# EasyEDA Pro project F401.eprj

# Schematic Schematic1
Board Name: Board1; Create Date: 2025-04-14; Page Name: P1; Project Name: F401; Schematic Name: Schematic1; Update Date: 2025-04-25; Company: 嘉立创EDA; Page Size: A4; Version: V1.0
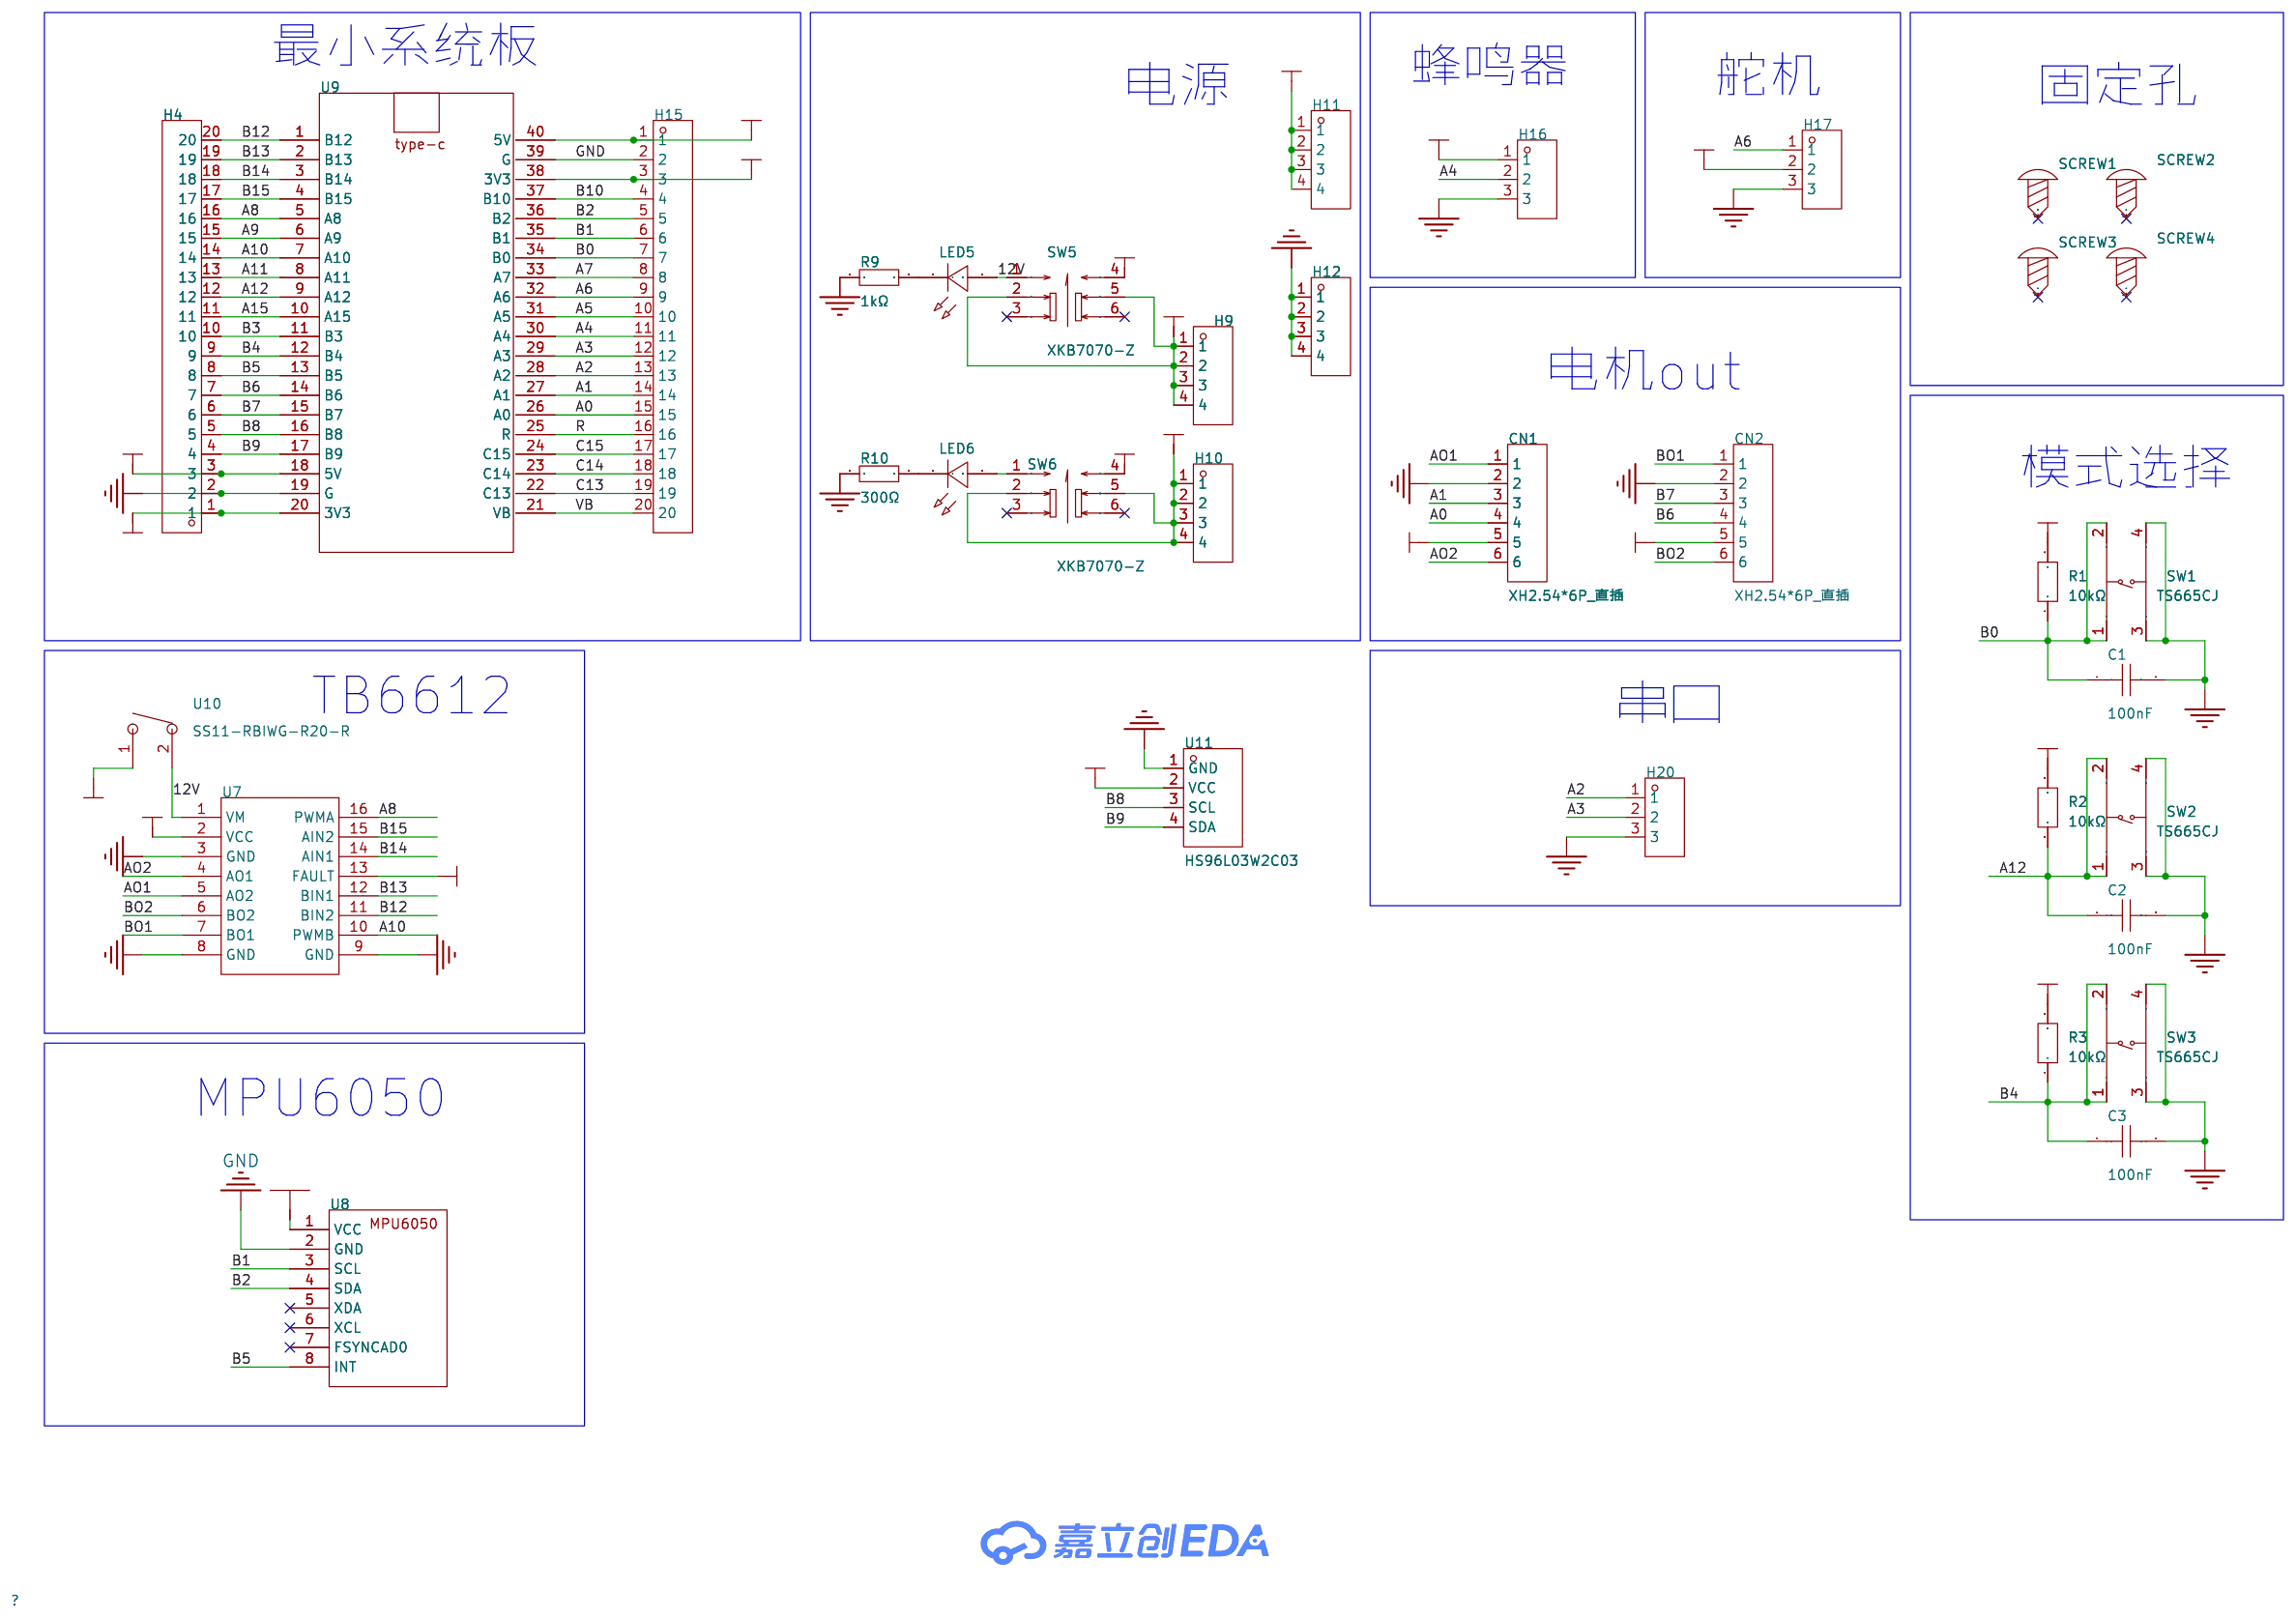
[diagram p0: schematic sheet]

## Parts
C1  100nF  [CAP-TH_L5.0-W2.5-P5.00-D1.0]
C2  100nF  [CAP-TH_L5.0-W2.5-P5.00-D1.0]
C3  100nF  [CAP-TH_L5.0-W2.5-P5.00-D1.0]
CN1  XH2.54*6P_直插  [CONN-TH_XH2.54-6P]
CN2  XH2.54*6P_直插  [CONN-TH_XH2.54-6P]
H4  -  [HDR-TH_20P-P2.54-V-M-1]
H9  -  [HDR-TH_4P-P2.54-V-M]
H10  -  [HDR-TH_4P-P2.54-V-M]
H11  -  [HDR-TH_4P-P2.54-V-M]
H12  -  [HDR-TH_4P-P2.54-V-M]
H15  -  [HDR-TH_20P-P2.54-V-M-1]
H16  -  [HDR-TH_3P-P2.54-V-F]
H17  -  [HDR-TH_3P-P2.54-V-M]
H20  -  [HDR-TH_3P-P2.54-V-M]
LED5  -  [LED-TH_5mm]
LED6  -  [LED-TH_5mm]
R1  10kΩ  [RES-TH_BD2.7-L6.2-P10.20-D0.4]
R2  10kΩ  [RES-TH_BD2.7-L6.2-P10.20-D0.4]
R3  10kΩ  [RES-TH_BD2.7-L6.2-P10.20-D0.4]
R9  1kΩ  [Res_1/4W]
R10  300Ω  [Res_1/4W]
SCREW1  -  [M3螺丝]
SCREW2  -  [M3螺丝]
SCREW3  -  [M3螺丝]
SCREW4  -  [M3螺丝]
SW1  TS665CJ  [SW-TH_4P-L6.0-W6.0-P4.50-LS6.5]
SW2  TS665CJ  [SW-TH_4P-L6.0-W6.0-P4.50-LS6.5]
SW3  TS665CJ  [SW-TH_4P-L6.0-W6.0-P4.50-LS6.5]
SW5  XKB7070-Z  [SW-TH_6P-L7.0-W7.0-P2.00]
SW6  XKB7070-Z  [SW-TH_6P-L7.0-W7.0-P2.00]
U7  -  [TB6612FNG]
U8  -  [MPU6050]
U9  -  [F401CCU6]
U10  SS11-RBIWG-R20-R  [SW-TH_L21.0-W15.0_SS11-RBIWG-R20-R]
U11  HS96L03W2C03  [OLED-TH_L27.8-W27.2-P2.54_C9900033791]

## Library data of the parts
C1-C3 = CC1H104MC1FD3F6C10MF: LCSC Part Name: 100nF ±20% 50V; Supplier Part: C254085; Manufacturer: Dersonic(德尔创); Supplier Footprint: 插件,P=5.08mm; JLCPCB Part Class: 扩展库; Datasheet: https://atta.szlcsc.com/upload/public/pdf/source/20200826/C254085_159DD65BF32BF11C9168D341BCE23E6F.pdf; Supplier: LCSC; Tolerance: ±20%; Voltage Rating: 50V; Pin Spacing: 5.08mm; Temperature Coefficient: Y5V; Diameter: 6mm; Body Thickness: 2.2mm
CN1 CN2 = XH2.54*6P_直插: Supplier Part: C9900008614; Supplier Footprint: XH2.54_6P; JLCPCB Part Class: 扩展库; Supplier: LCSC
H4 H15 = HDR-M_2.54_1x20P: 间距:2.54mm;总PIN位数:20;排数:1;插针结构:-;行距:-;安装类型:直插;圆针/方针:-;额定电流:-;额定电压:-;配合针长度:-;塑高:-;触头材质:黄铜;触头镀层:-;颜色:黑色;; Supplier Part: C50981; Supplier Footprint: 插件
H9-H12 = HDR-M_2.54_1x4P: Supplier Part: C492403; Supplier Footprint: 插件
H16 = HDR-F_2.54_1x3P: Supplier Part: C541850; Supplier Footprint: 插件
H17 H20 = HDR-M_2.54_1x3P: Supplier Part: C2937625; Supplier Footprint: 插件
LED5 LED6 = LED_TH-R_5mm: Supplier Footprint: 插件
R1-R3 = MF1/4W-1K±1%-ST52: LCSC Part Name: 金属膜电阻 1kΩ ±1% 250mW; Supplier Part: C2903245; Manufacturer: VO(翔胜); Supplier Footprint: 插件,D2.7xL6.2mm; JLCPCB Part Class: 扩展库; Datasheet: https://atta.szlcsc.com/upload/public/pdf/source/20200609/C601728_5AA4C0C8E12E11069DA2C3356F29D1F2.pdf; Supplier: LCSC; Type: 金属膜电阻; Tolerance: ±1%; Overload Voltage (Max): 250V; Power(Watts): 250mW; Temperature Coefficient: ±100ppm/℃; Operating Temperature Range: -55℃~+155℃
R9 R10 = Res_AXIAL-1/4W: Supplier Footprint: 轴向引线
SCREW1-SCREW4 = M3螺丝: Supplier Footprint: 插件
SW1-SW3 = TS665CJ: LCSC Part Name: 6*6*5mm 直插 轻触开关; Supplier Part: C393938; Manufacturer: SHOU HAN(首韩); Supplier Footprint: 插件; JLCPCB Part Class: 扩展库; Datasheet: https://atta.szlcsc.com/upload/public/pdf/source/20190521/C393938_BDABEAC600B4C55E200A80AA129B70BC.pdf; Supplier: LCSC; Circuit: 单刀单掷; Actuator Style: 圆形按钮; Mounting Style: 直插; Switch Length: 6mm; Switch Width: 6mm; Switch Height: 5mm; Contact Current: 50mA; Voltage Rating (DC): 12V
SW5 SW6 = XKB7070-Z: LCSC Part Name: 按键开关   7*7插件自锁 蓝白黑; Supplier Part: C318863; Manufacturer: XKB Connectivity(中国星坤); Supplier Footprint: 插件; Datasheet: https://atta.szlcsc.com/upload/public/pdf/source/20211015/75A682A27A424BDE8D93C2CFA14C38FE.pdf; Supplier: LCSC; Self Lock / No Lock: 自锁; Actuator Style: 矩形按钮; Mounting Style: 直插; Contact Current: 100mA; Voltage Rating (AC): 250V; Voltage Rating (DC): 30V; Insulation Resistance: 100MΩ; Actuator/Cap Color: 蓝色; With Lamp: 不带; Pin Style: PC引脚; Operating Force: 160gf; Operating Temperature: -15℃~+55℃; Mechanical Life: 10万次
U7 = TB6612FNG
U8 = MPU6050
U9 = F401CCU6
U10 = SS11-RBIWG-R20-R: LCSC Part Name: 翘板开关船型开关 电源开关; Supplier Part: C5186963; Manufacturer: Legion(六钧); Supplier Footprint: 插件; Datasheet: https://atta.szlcsc.com/upload/public/pdf/source/20221116/4827089DB39A8210C60F541CC13B896F.pdf; Supplier: LCSC; Switch Length: 21mm; Switch Width: 15mm; Actuator Type: 凹面弯曲; With Lamp: 无; Actuator Color: 红色; Contact Current: 16A; Voltage Rating (AC): 250V; Circuit: 单刀单掷; Mechanical Life: 1万次; Operating Temperature: -40℃~+125℃; Actuator Identifier: - O
U11 = HS96L03W2C03: LCSC Part Name: 0.96寸OLED显示屏窄白光IIC; Supplier Part: C5248080; Manufacturer: HS(汉昇); JLCPCB Part Class: 扩展库; Datasheet: https://atta.szlcsc.com/upload/public/pdf/source/20230627/763D01F79A90007632F098068C7C8AD9.pdf; Supplier: LCSC; Main Control Chip: SSD1315; Interface Type: I2C; Size: 0.96; Pixel Resolution: 128x64; Operating Temperature: -40℃~+70℃

## Nets
3V3: H4.1 H11.1 H11.2 H11.3 H11.4 H15.3 H16.1 R1.2 R2.2 R3.2 U9.20(3V3) U9.38(3V3) U11.2(VCC)
5V: CN1.5 CN2.5 H4.3 H10.1 H10.2 H10.3 H10.4 H15.1 H17.2 SW6.2 SW6.4 SW6.5 U7.2(VCC) U7.13(FAULT) U8.1(VCC) U9.18(5V) U9.40(5V)
12V: H9.1 H9.2 H9.3 H9.4 LED5.1(C) SW5.1 SW5.2 SW5.4 SW5.5 U7.1(VM) U10.1 U10.2
GND: C1.2 C2.2 C3.2 CN1.2 CN2.2 H4.2 H12.1 H12.2 H12.3 H12.4 H15.2 H16.3 H17.3 H20.3 R9.1 R10.1 SW1.3(C) SW1.4(D) SW2.3(C) SW2.4(D) SW3.3(C) SW3.4(D) U7.3(GND) U7.8(GND) U7.9(GND) U8.2(GND) U9.19(G) U9.39(G) U11.1(GND)
A0: CN1.4 H15.15 U9.26(A0)
A1: CN1.3 H15.14 U9.27(A1)
A2: H15.13 H20.1 U9.28(A2)
A3: H15.12 H20.2 U9.29(A3)
A4: H15.11 H16.2 U9.30(A4)
A5: H15.10 U9.31(A5)
A6: H15.9 H17.1 U9.32(A6)
A7: H15.8 U9.33(A7)
A8: H4.16 U7.16(PWMA) U9.5(A8)
A9: H4.15 U9.6(A9)
A10: H4.14 U7.10(PWMB) U9.7(A10)
A11: H4.13 U9.8(A11)
A12: C2.1 H4.12 R2.1 SW2.1(A) SW2.2(B) U9.9(A12)
A15: H4.11 U9.10(A15)
AO1: CN1.1 U7.5(AO2)
AO2: CN1.6 U7.4(AO1)
B0: C1.1 H15.7 R1.1 SW1.1(A) SW1.2(B) U9.34(B0)
B1: H15.6 U8.3(SCL) U9.35(B1)
B2: H15.5 U8.4(SDA) U9.36(B2)
B3: H4.10 U9.11(B3)
B4: C3.1 H4.9 R3.1 SW3.1(A) SW3.2(B) U9.12(B4)
B5: H4.8 U8.8(INT) U9.13(B5)
B6: CN2.4 H4.7 U9.14(B6)
B7: CN2.3 H4.6 U9.15(B7)
B8: H4.5 U9.16(B8) U11.3(SCL)
B9: H4.4 U9.17(B9) U11.4(SDA)
B10: H15.4 U9.37(B10)
B12: H4.20 U7.11(BIN2) U9.1(B12)
B13: H4.19 U7.12(BIN1) U9.2(B13)
B14: H4.18 U7.14(AIN1) U9.3(B14)
B15: H4.17 U7.15(AIN2) U9.4(B15)
BO1: CN2.1 U7.7(BO1)
BO2: CN2.6 U7.6(BO2)
C13: H15.19 U9.22(C13)
C14: H15.18 U9.23(C14)
C15: H15.17 U9.24(C15)
R: H15.16 U9.25(R)
VB: H15.20 U9.21(VB)
$1N11569: LED6.2(A) R10.2
$1N12499: LED5.2(A) R9.2
$1N12503: LED6.1(C) SW6.1

Not connected (* = marked no-connect by the designer): SCREW1 1*; SCREW2 1*; SCREW3 1*; SCREW4 1*; SW5 3* 6*; SW6 3* 6*; U8 5(XDA)* 6(XCL)* 7(FSYNCAD0)*

## Notes on the sheet
- 最小系统板
- 蜂鸣器
- 电源
- 舵机
- 固定孔
- 电机out
- 模式选择
- TB6612
- 串口
- MPU6050

# Board PCB1
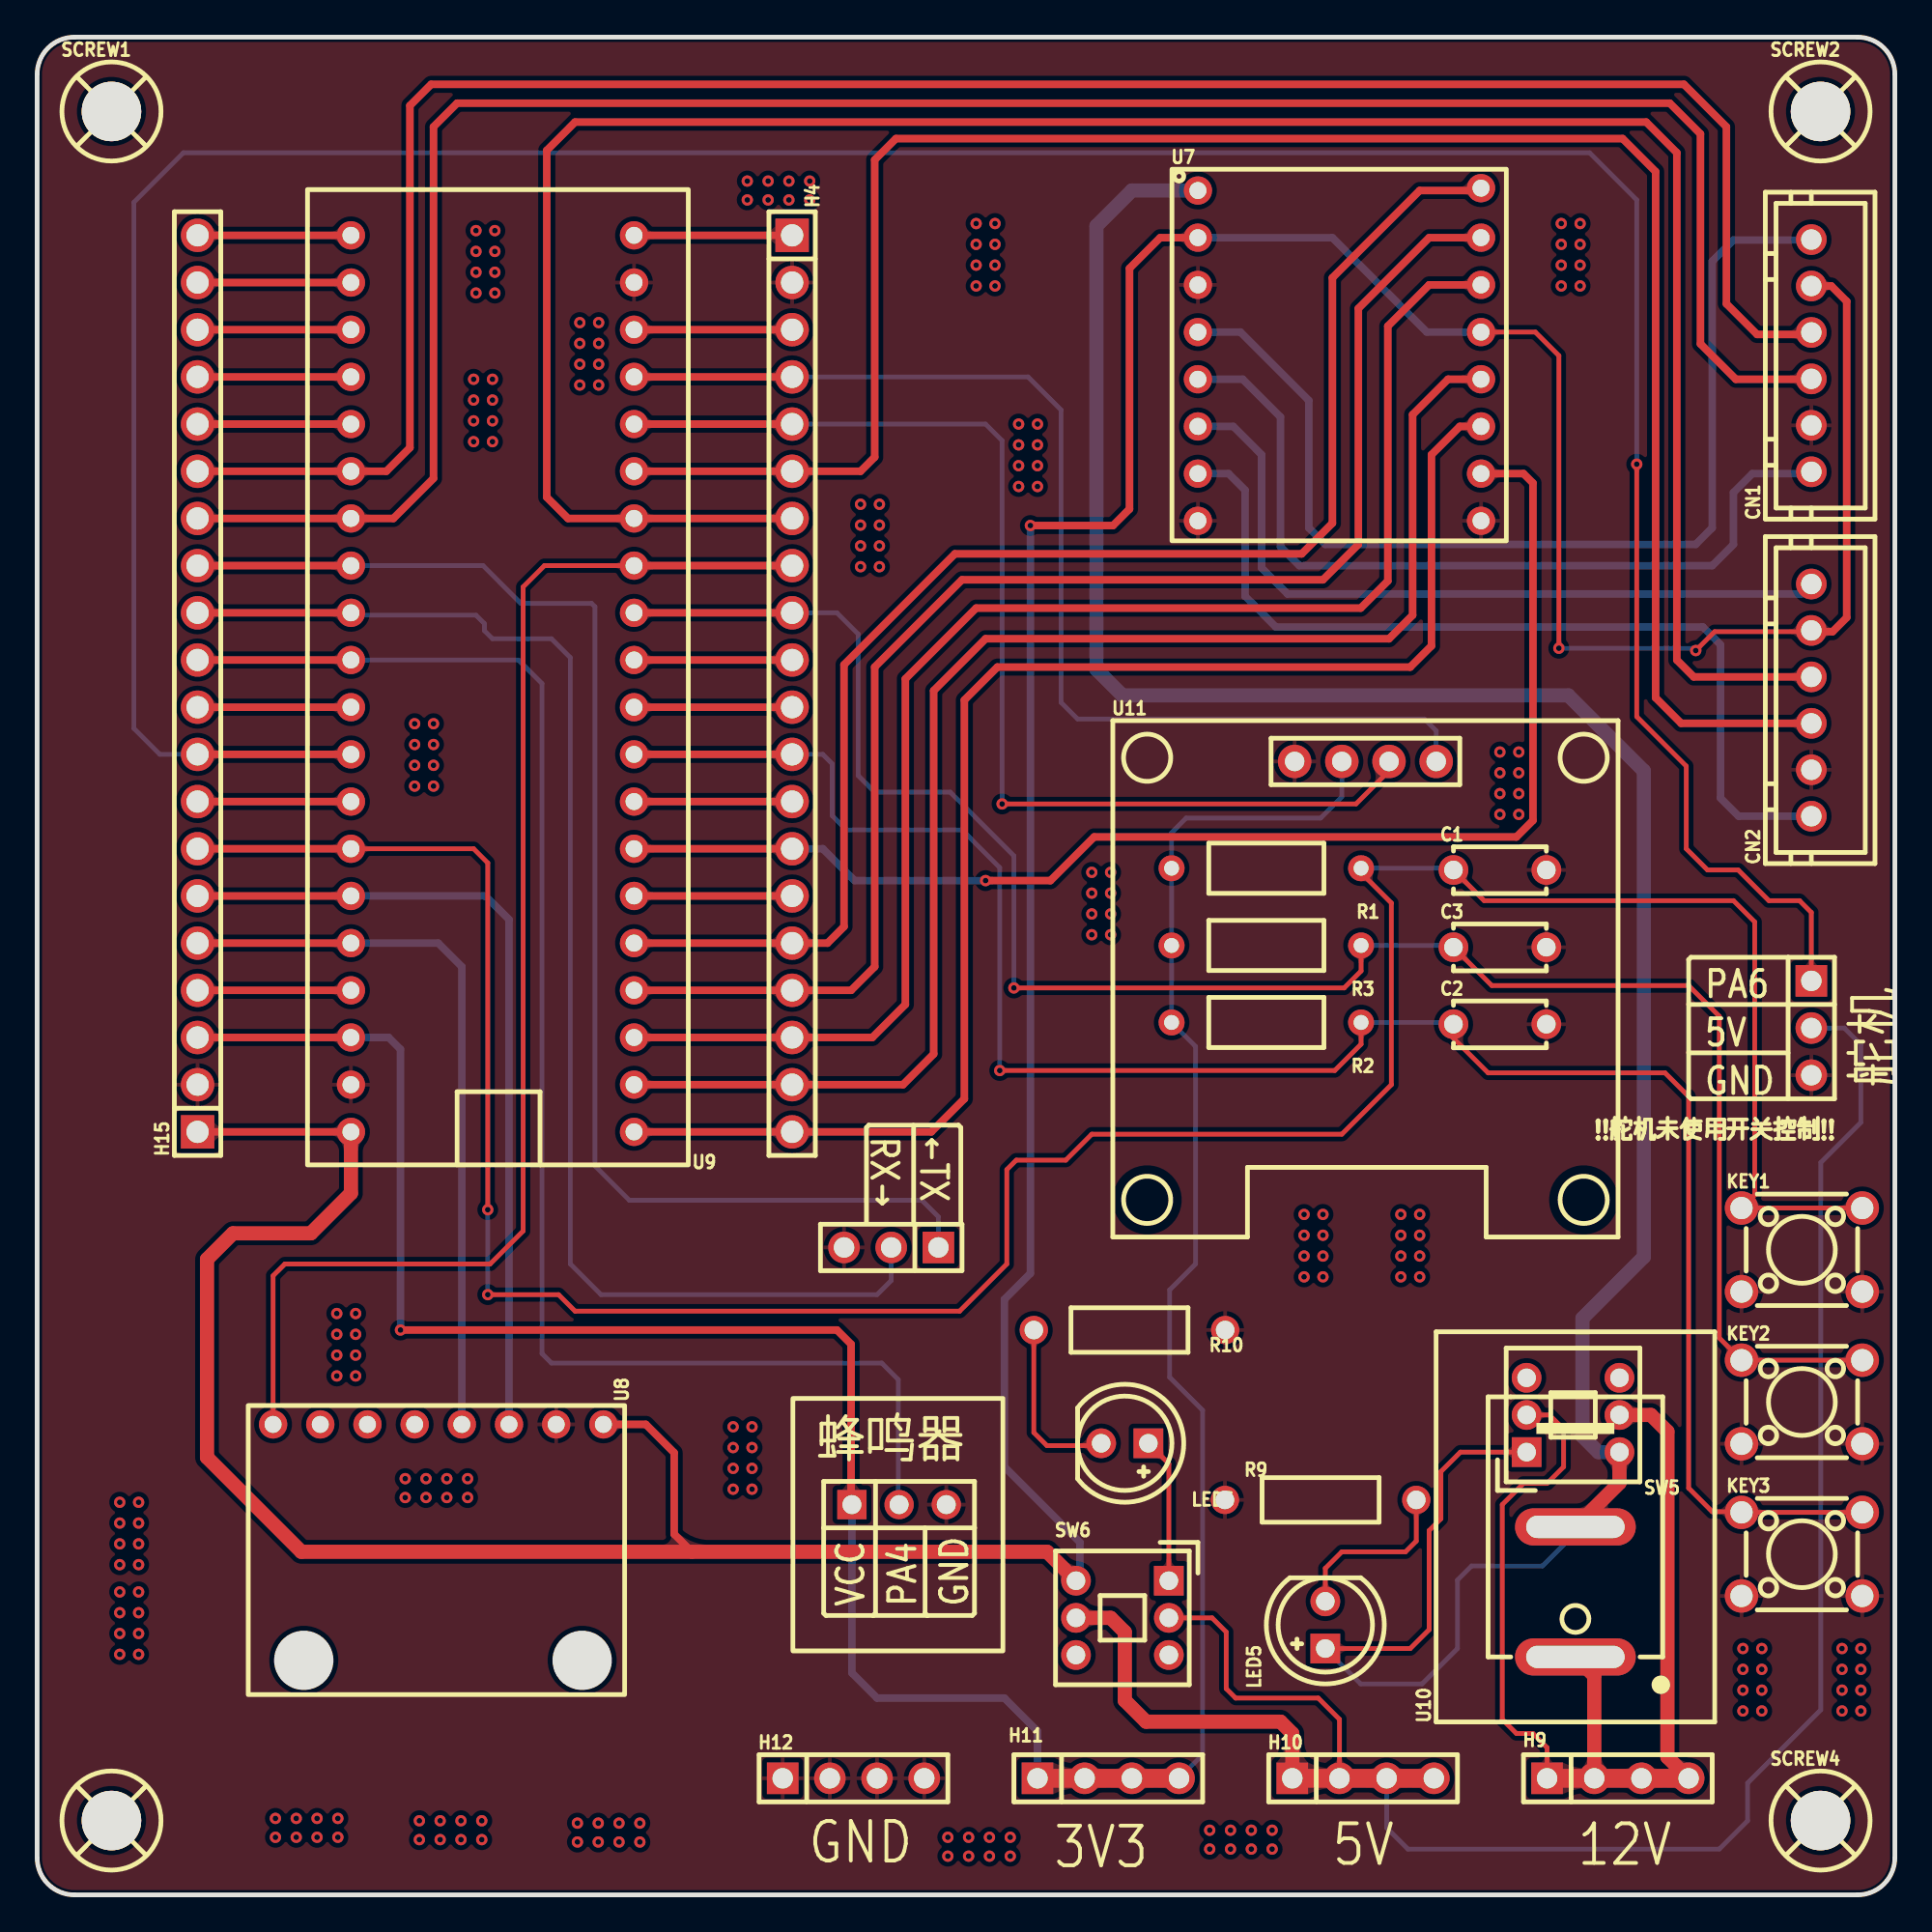
[diagram p1: board, top side]
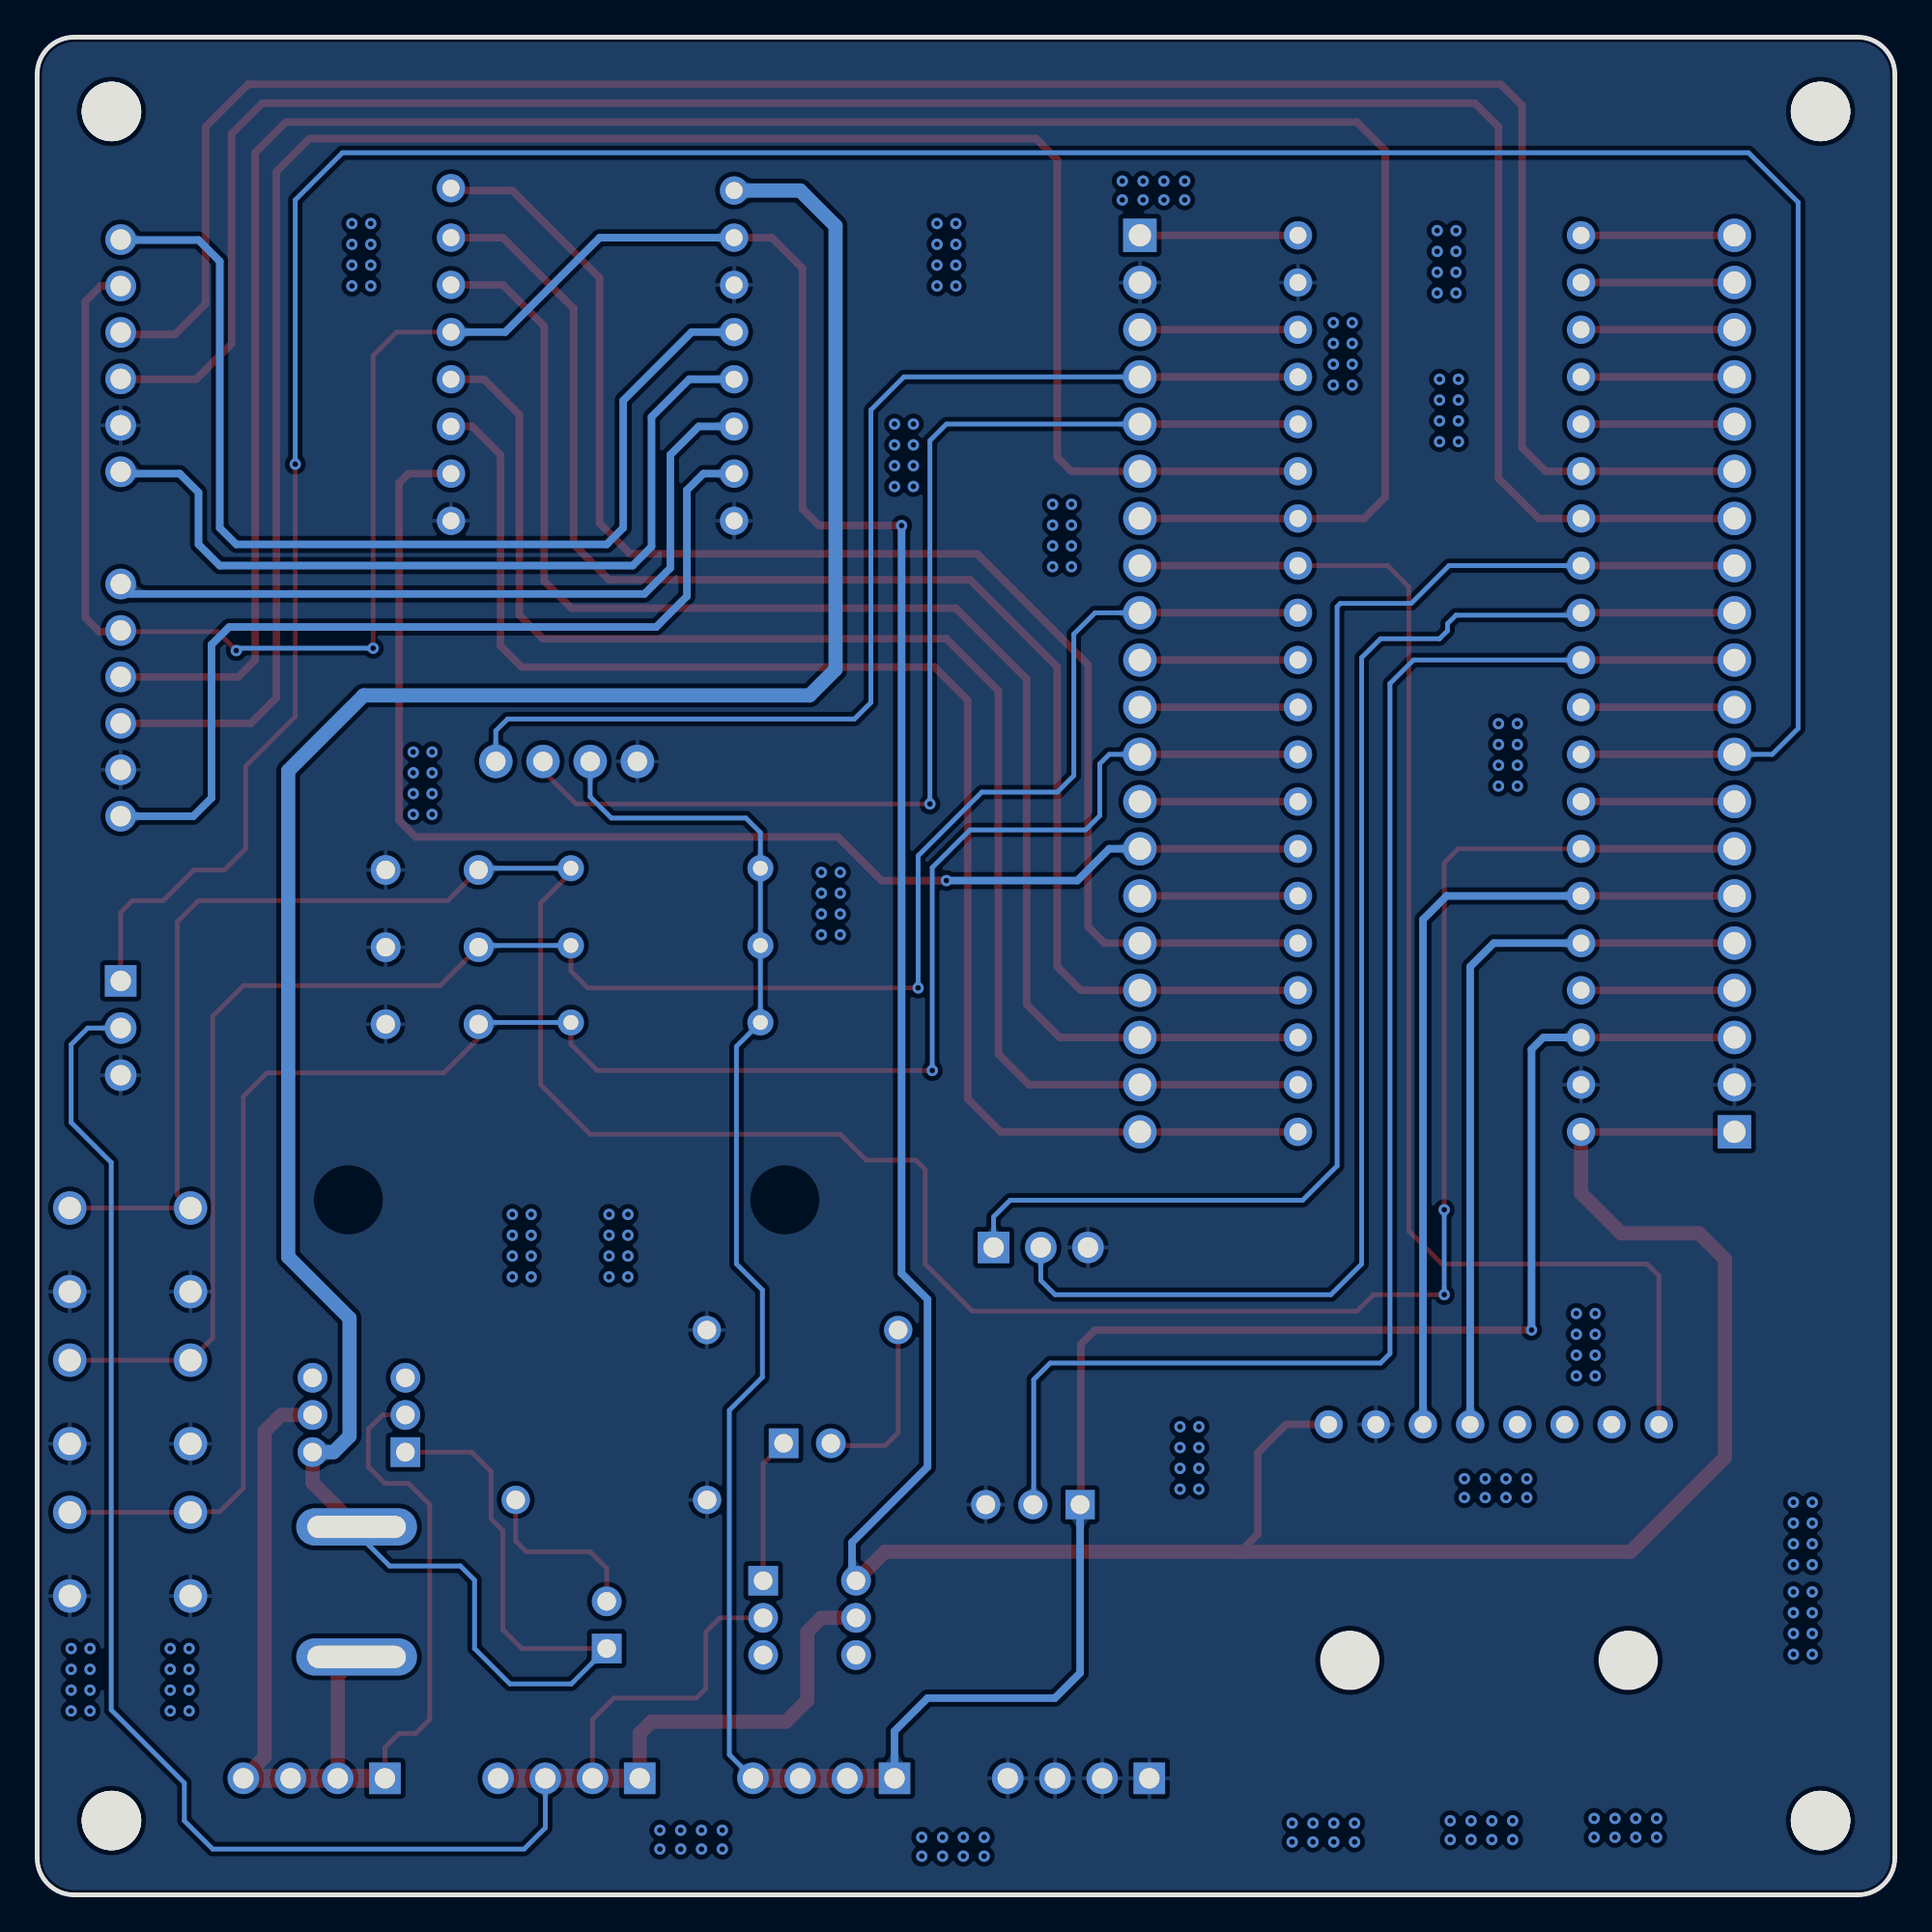
[diagram p2: board, bottom side, seen from below]

Outline 100 x 100 mm; copper layers: Top Layer, Bottom Layer. Coordinates in mm from the lower left corner of the outline.
Outline path: 0,98 0,2 arc(0.59,0.59) 2,0 98,0 arc(99.41,0.59) 100,2 100,98 arc(99.41,99.41) 98,100 2,100 arc(0.59,99.41) 0,98
Stack: Top Layer 0.035mm / Dielectric1 1.51mm FR4 er 4.5 / Bottom Layer 0.035mm

## Design rules (mm)
template: JLCPCB Capability(Two Layers Board)
spacing copperThickness1oz (default): track to track 0.102, other pairs 0.152 to 0.3
spacing copperThickness2oz: track to track 0.203, other pairs 0.152 to 0.3
track width copperThickness1oz (default): min 0.127, default 0.254, max 2.54
track width copperThickness2oz: min 0.203, default 0.254, max 2.54
differential pair differentialPair (default): width min 0.127, default 0.254, max 2.54; gap min 0.152, default 0.152
via viaSize (default): diameter min 0.5, default 0.61, max 10; hole min 0.3, default 0.305, max 6.3

## Placement (name value [footprint] x y rotation side)
C1  100nF  [CAP-TH_L5.0-W2.5-P5.00-D1.0]  78.74 55.17 0 top
C2  100nF  [CAP-TH_L5.0-W2.5-P5.00-D1.0]  78.74 46.87 0 top
C3  100nF  [CAP-TH_L5.0-W2.5-P5.00-D1.0]  78.74 51.01 0 top
CN1  XH2.54*6P_直插  [CONN-TH_XH2.54-6P]  95.5 82.86 90 top
CN2  XH2.54*6P_直插  [CONN-TH_XH2.54-6P]  95.5 64.31 90 top
H4  -  [HDR-TH_20P-P2.54-V-M-1]  40.64 65.2 270 top
H9  -  [HDR-TH_4P-P2.54-V-M]  85.09 6.27 0 top
H10  -  [HDR-TH_4P-P2.54-V-M]  71.37 6.27 0 top
H11  -  [HDR-TH_4P-P2.54-V-M]  57.66 6.27 0 top
H12  -  [HDR-TH_4P-P2.54-V-M]  43.94 6.27 0 top
H15  -  [HDR-TH_20P-P2.54-V-M-1]  8.64 65.2 90 top
H16  -  [HDR-TH_3P-P2.54-V-F]  46.4 21.01 0 top
H17  -  [HDR-TH_3P-P2.54-V-M]  95.5 46.66 270 top
H20  -  [HDR-TH_3P-P2.54-V-M]  45.97 34.85 180 top
KEY1  TS665CJ  [SW-TH_4P-L6.0-W6.0-P4.50-LS6.5]  95 34.72 0 top
KEY2  TS665CJ  [SW-TH_4P-L6.0-W6.0-P4.50-LS6.5]  95 26.53 0 top
KEY3  TS665CJ  [SW-TH_4P-L6.0-W6.0-P4.50-LS6.5]  95 18.34 0 top
LED5  -  [LED-TH_5mm]  69.34 14.53 90 top
LED6  -  [LED-TH_5mm]  58.55 24.31 180 top
R1  10kΩ  [RES-TH_BD2.7-L6.2-P10.20-D0.4]  66.17 55.26 180 top
R2  10kΩ  [RES-TH_BD2.7-L6.2-P10.20-D0.4]  66.17 46.96 180 top
R3  10kΩ  [RES-TH_BD2.7-L6.2-P10.20-D0.4]  66.17 51.11 180 top
R9  1kΩ  [Res_1/4W]  69.09 21.26 0 top
R10  300Ω  [Res_1/4W]  58.8 30.4 180 top
SCREW1  -  [M3螺丝]  4 96 0 top
SCREW2  -  [M3螺丝]  96 96 0 top
SCREW3  -  [M3螺丝]  4 4 0 top
SCREW4  -  [M3螺丝]  96 4 0 top
SW5  XKB7070-Z  [SW-TH_6P-L7.0-W7.0-P2.00]  82.68 25.83 180 top
SW6  XKB7070-Z  [SW-TH_6P-L7.0-W7.0-P2.00]  58.42 14.91 0 top
U7  -  [TB6612FNG]  62.48 91.75 0 top
U8  -  [MPU6050]  30.48 25.32 270 top
U9  -  [F401CCU6]  32.13 41.07 180 top
U10  SS11-RBIWG-R20-R  [SW-TH_L21.0-W15.0_SS11-RBIWG-R20-R]  82.8 16.31 90 top
U11  HS96L03W2C03  [OLED-TH_L27.8-W27.2-P2.54_C9900033791]  71.5 61.01 0 top

## Footprints (pads in the part's own frame, mm; a bottom-side part is the same pattern mirrored in y, then rotated)
CAP-TH_L5.0-W2.5-P5.00-D1.0
  round 1.6 hole 1: 1(-2.5,0) 2(2.5,0)
CONN-TH_XH2.54-6P
  round 1.65 hole 1.1: 1(-6.25,0) 2(-3.75,0) 3(-1.25,0) 4(1.25,0) 5(3.75,0) 6(6.25,0)
F401CCU6
  round 1.524 hole 0.914: 1(0,0) 2(0,-2.54) 3(0,-5.08) 4(0,-7.62) 5(0,-10.16) 6(0,-12.7) 7(0,-15.24) 8(0,-17.78) 9(0,-20.32) 10(0,-22.86) 11(0,-25.4) 12(0,-27.94) 13(0,-30.48) 14(0,-33.02) 15(0,-35.56) 16(0,-38.1) 17(0,-40.64) 18(0,-43.18) 19(0,-45.72) 20(0,-48.26) 21(15.24,-48.26) 22(15.24,-45.72) 23(15.24,-43.18) 24(15.24,-40.64) 25(15.24,-38.1) 26(15.24,-35.56) 27(15.24,-33.02) 28(15.24,-30.48) 29(15.24,-27.94) 30(15.24,-25.4) 31(15.24,-22.86) 32(15.24,-20.32) 33(15.24,-17.78) 34(15.24,-15.24) 35(15.24,-12.7) 36(15.24,-10.16) 37(15.24,-7.62) 38(15.24,-5.08) 39(15.24,-2.54) 40(15.24,0)
HDR-TH_3P-P2.54-V-F
  rect 1.575x1.575 hole 1.02: 1(-2.54,0)
  round 1.575 hole 1.02: 2(0,0) 3(2.54,0)
HDR-TH_3P-P2.54-V-M
  rect 1.7x1.7 hole 1.1: 1(-2.54,0)
  round 1.7 hole 1.1: 2(0,0) 3(2.54,0)
HDR-TH_4P-P2.54-V-M
  rect 1.7x1.7 hole 1.1: 1(-3.81,0)
  round 1.7 hole 1.1: 2(-1.27,0) 3(1.27,0) 4(3.81,0)
HDR-TH_20P-P2.54-V-M-1
  rect 1.8x1.8 hole 1.2: 1(-24.13,0)
  round 1.8 hole 1.2: 2(-21.59,0) 3(-19.05,0) 4(-16.51,0) 5(-13.97,0) 6(-11.43,0) 7(-8.89,0) 8(-6.35,0) 9(-3.81,0) 10(-1.27,0) 11(1.27,0) 12(3.81,0) 13(6.35,0) 14(8.89,0) 15(11.43,0) 16(13.97,0) 17(16.51,0) 18(19.05,0) 19(21.59,0) 20(24.13,0)
LED-TH_5mm
  rect 1.6x1.6 hole 1: 1(-1.27,0)
  round 1.6 hole 1: 2(1.27,0)
M3螺丝
  round 3.2 hole 3.2: 1(0,0)
MPU6050
  round 1.524 hole 0.914: 1(0,0) 2(0,-2.54) 3(0,-5.08) 4(0,-7.62) 5(0,-10.16) 6(0,-12.7) 7(0,-15.24) 8(0,-17.78)
OLED-TH_L27.8-W27.2-P2.54_C9900033791
  round 1.8 hole 1.05: 1(-3.81,0) 2(-1.27,0) 3(1.27,0) 4(3.81,0)
RES-TH_BD2.7-L6.2-P10.20-D0.4
  round 1.4 hole 0.8: 1(-5.1,0) 2(5.1,0)
Res_1/4W
  round 1.524 hole 1: 1(-5.15,0) 2(5.15,0)
SW-TH_4P-L6.0-W6.0-P4.50-LS6.5
  round 1.8 hole 1.2: 1(-3.25,2.25) 2(3.25,2.25) 3(-3.25,-2.25) 4(3.25,-2.25)
SW-TH_6P-L7.0-W7.0-P2.00
  rect 1.6x1.6 hole 1: 1(2.499,2)
  round 1.6 hole 1: 2(2.5,0) 3(2.5,-2) 4(-2.5,2) 5(-2.5,0) 6(-2.5,-2)
SW-TH_L21.0-W15.0_SS11-RBIWG-R20-R
  oval 2x6.5 hole 1.2x5.3: 1(-3.5,0) 2(3.5,0)
TB6612FNG
  round 1.524 hole 0.914: 1(0,0) 2(0,-2.54) 3(0,-5.08) 4(0,-7.62) 5(0,-10.16) 6(0,-12.7) 7(0,-15.24) 8(0,-17.78) 9(15.24,-17.78) 10(15.24,-15.24) 11(15.24,-12.7) 12(15.24,-10.16) 13(15.24,-7.62) 14(15.24,-5.08) 15(15.24,-2.54) 16(15.24,0.127)

## Nets
As in the schematic, except:
GND: C1.2 C2.2 C3.2 CN1.2 CN2.2 H4.2 H12.1 H12.2 H12.3 H12.4 H15.2 H16.3 H17.3 H20.3 KEY1.3 KEY1.4 KEY2.3 KEY2.4 KEY3.3 KEY3.4 R9.1 R10.1 U7.3 U7.8 U7.9 U8.2 U9.19 U9.39 U11.1
A12: C2.1 H4.12 KEY3.1 KEY3.2 R2.1 U9.9
B0: C1.1 H15.7 KEY1.1 KEY1.2 R1.1 U9.34
B4: C3.1 H4.9 KEY2.1 KEY2.2 R3.1 U9.12

Pads without a net: SCREW1 1; SCREW2 1; SCREW3 1; SCREW4 1; SW5 3 6; SW6 3 6; U8 5 6 7

## Via types
v1: diameter 0.61, hole 0.305, Top Layer to Bottom Layer, 211 vias

## Routing (per net, layer and track width the routed paths; a pad name or vN(x,y) marks a point on that pad's centre or on a via; arc(x,y) is an arc through that point)
3V3: length 163.7
  Top Layer w0.406: H15.3 U9.38 ; U9.20 H4.1 ; v1(19.56,30.4) 43.05,30.4 43.81,29.64 43.81,21.05 H16.1
  Top Layer w1.016: H11.4 H11.3 H11.2 H11.1
  Bottom Layer w0.254: H11.4 62.74,7.54 62.74,26.09 60.96,27.86 60.96,32.56 62.36,33.96 62.36,45.67 R2.2 R3.2 R1.2 61.07,57.18 61.85,57.96 69.09,57.96 70.23,59.11 U11.2
  Bottom Layer w0.406: H11.1 53.85,8.81 52.07,10.59 45.21,10.59 43.86,11.95 H16.1 ; v1(19.56,30.4) 19.56,45.52 18.92,46.15 U9.38
5V: length 368.6
  Top Layer w0.254: U7.13 80.65,84.12 81.91,82.86 v1(81.91,67.11) ; 95.57,68 90.3,68 v1(89.28,66.98) ; H10.2 70.1,9.45 68.96,10.59 64.52,10.59 64.01,11.1 64.01,14.15 63.25,14.91 SW6.2
  Top Layer w0.406: U7.2 60.45,89.2 58.8,87.55 58.8,74.6 57.91,73.71 v1(53.47,73.71) ; 35.24,18.47 34.29,19.42 34.29,23.8 32.77,25.32 U8.1 ; H15.1 U9.40 ; CN2.5 95.57,68 96.65,68 97.41,68.76 97.41,85.78 96.58,86.61 CN1.5 ; U9.18 H4.3
  Top Layer w0.762: SW6.5 57.78,14.91 58.55,14.15 58.55,10.47 59.69,9.32 66.93,9.32 67.56,8.69 H10.1 ; SW6.4 54.36,18.47 14.22,18.47 9.14,23.55 9.14,34.21 10.54,35.61 14.73,35.61 16.89,37.77 U9.40
  Top Layer w1.016: H10.1 H10.2 H10.3 H10.4
  Bottom Layer w0.254: v1(81.91,67.11) 89.15,67.11 v1(89.28,66.98) ; H10.3 72.64,3.61 73.79,2.46 90.55,2.46 92.07,3.99 92.07,6.02 96.01,9.96 96.01,39.42 98.17,41.58 98.17,45.77 97.28,46.66 H17.2
  Bottom Layer w0.406: U7.13 74.8,84.12 69.72,89.2 U7.2 ; SW6.4 56.13,17.12 56.13,18.97 52.07,23.04 52.07,32.06 53.47,33.45 v1(53.47,73.71)
12V: length 207.4
  Top Layer w0.254: LED5.1 73.91,13.26 74.93,14.28 74.93,19.61 75.56,20.24 75.56,22.78 76.61,23.83 SW5.1 ; SW5.2 81.41,25.83 82.17,25.07 82.17,23.04 81.28,22.15 80.01,22.15 78.87,21.01 78.87,9.45 79.63,8.69 80.52,8.69 81.28,7.93 H9.1
  Top Layer w0.762: U10.2 85.18,22.18 SW5.4 ; H9.2 83.82,11.79 U10.1 ; H9.4 87.76,7.42 87.76,24.94 86.87,25.83 SW5.5
  Top Layer w1.016: 88.52,6.15 88.39,6.27 H9.3 H9.2 H9.1
  Bottom Layer w0.254: U10.2 82.8,19.48 81.03,17.7 77.22,17.7 76.45,16.94 76.45,13.26 74.55,11.35 71.25,11.35 LED5.1
  Bottom Layer w0.762: SW5.4 84.04,23.83 83.19,24.69 83.19,31.04 86.49,34.34 86.49,60.5 82.42,64.57 58.42,64.57 57.02,65.96 57.02,89.84 58.93,91.75 U7.1
(no net):
  vias: v1(4.44,21.13) v1(4.44,20.01) v1(4.44,18.89) v1(4.44,17.77) v1(4.44,16.31) v1(4.44,15.19) v1(4.44,14.07) v1(4.44,12.95) v1(5.46,21.13) v1(5.46,20.01) v1(5.46,18.89) v1(5.46,17.77) v1(5.46,16.31) v1(5.46,15.19) v1(5.46,14.07) v1(5.46,12.95) v1(12.83,4.12) v1(12.83,3.1) v1(13.95,4.12) v1(13.95,3.1) v1(15.07,4.12) v1(15.07,3.1) v1(16.13,31.29) v1(16.13,30.17) v1(16.13,29.05) v1(16.13,27.93) v1(16.19,4.12) v1(16.19,3.1) v1(17.14,31.29) v1(17.14,30.17) v1(17.14,29.05) v1(17.14,27.93) v1(19.81,22.4) v1(19.81,21.39) v1(20.32,63.04) v1(20.32,61.92) v1(20.32,60.8) v1(20.32,59.68) v1(20.57,3.99) v1(20.57,2.97) v1(20.93,22.4) v1(20.93,21.39) v1(21.34,63.04) v1(21.34,61.92) v1(21.34,60.8) v1(21.34,59.68) v1(21.69,3.99) v1(21.69,2.97) v1(22.05,22.4) v1(22.05,21.39) v1(22.81,3.99) v1(22.81,2.97) v1(23.17,22.4) v1(23.17,21.39) v1(23.5,81.58) v1(23.5,80.47) v1(23.5,79.35) v1(23.5,78.23) v1(23.62,89.59) v1(23.62,88.47) v1(23.62,87.35) v1(23.62,86.23) v1(23.93,3.99) v1(23.93,2.97) v1(24.51,81.58) v1(24.51,80.47) v1(24.51,79.35) v1(24.51,78.23) v1(24.64,89.59) v1(24.64,88.47) v1(24.64,87.35) v1(24.64,86.23) v1(29.08,3.86) v1(29.08,2.84) v1(29.21,84.63) v1(29.21,83.51) v1(29.21,82.39) v1(29.21,81.27) v1(30.23,84.63) v1(30.23,83.51) v1(30.23,82.39) v1(30.23,81.27) v1(30.2,3.86) v1(30.2,2.84) v1(31.32,3.86) v1(31.32,2.84) v1(32.44,3.86) v1(32.44,2.84) v1(37.47,25.2) v1(37.47,24.08) v1(37.47,22.96) v1(37.47,21.84) v1(38.23,92.25) v1(38.23,91.24) v1(38.48,25.2) v1(38.48,24.08) v1(38.48,22.96) v1(38.48,21.84) v1(39.35,92.25) v1(39.35,91.24) v1(40.47,92.25) v1(40.47,91.24) v1(41.59,92.25) v1(41.59,91.24) v1(44.32,74.85) v1(44.32,73.73) v1(44.32,72.61) v1(44.32,71.49) v1(45.34,74.85) v1(45.34,73.73) v1(45.34,72.61) v1(45.34,71.49) v1(49.02,3.1) v1(49.02,2.08) v1(50.14,3.1) v1(50.14,2.08) v1(50.55,89.97) v1(50.55,88.85) v1(50.55,87.73) v1(50.55,86.61) v1(51.26,3.1) v1(51.26,2.08) v1(51.56,89.97) v1(51.56,88.85) v1(51.56,87.73) v1(51.56,86.61) v1(52.38,3.1) v1(52.38,2.08) v1(52.83,79.17) v1(52.83,78.05) v1(52.83,76.93) v1(52.83,75.81) v1(53.85,79.17) v1(53.85,78.05) v1(53.85,76.93) v1(53.85,75.81) v1(56.77,55.04) v1(56.77,53.92) v1(56.77,52.8) v1(56.77,51.68) v1(57.78,55.04) v1(57.78,53.92) v1(57.78,52.8) v1(57.78,51.68) v1(63.12,3.48) v1(63.12,2.46) v1(64.24,3.48) v1(64.24,2.46) v1(65.36,3.48) v1(65.36,2.46) v1(66.48,3.48) v1(66.48,2.46) v1(68.2,36.63) v1(68.2,35.51) v1(68.2,34.39) v1(68.2,33.27) v1(69.22,36.63) v1(69.22,35.51) v1(69.22,34.39) v1(69.22,33.27) v1(73.41,36.63) v1(73.41,35.51) v1(73.41,34.39) v1(73.41,33.27) v1(74.42,36.63) v1(74.42,35.51) v1(74.42,34.39) v1(74.42,33.27) v1(78.74,61.52) v1(78.74,60.4) v1(78.74,59.28) v1(78.74,58.16) v1(79.76,61.52) v1(79.76,60.4) v1(79.76,59.28) v1(79.76,58.16) v1(82.04,89.97) v1(82.04,88.85) v1(82.04,87.73) v1(82.04,86.61) v1(83.06,89.97) v1(83.06,88.85) v1(83.06,87.73) v1(83.06,86.61) v1(91.82,13.26) v1(91.82,12.14) v1(91.82,11.02) v1(91.82,9.9) v1(92.84,13.26) v1(92.84,12.14) v1(92.84,11.02) v1(92.84,9.9) v1(97.16,13.26) v1(97.16,12.14) v1(97.16,11.02) v1(97.16,9.9) v1(98.17,13.26) v1(98.17,12.14) v1(98.17,11.02) v1(98.17,9.9)
A0: length 117.5
  Top Layer w0.406: CN1.4 95.4,84 92.58,84 90.93,85.65 90.93,95.17 88.65,97.46 21.21,97.46 20.07,96.32 20.07,77.9 18.8,76.63 U9.26 H15.15
A1: length 120
  Top Layer w0.406: CN1.3 95.48,81.58 91.44,81.58 89.53,83.49 89.53,94.79 87.88,96.44 22.61,96.44 21.34,95.17 21.34,76.25 19.18,74.09 U9.27 H15.14
A2: length 73.7
  Top Layer w0.406: H15.13 U9.28
  Bottom Layer w0.254: U9.28 24,71.55 26.03,69.52 29.84,69.52 30.02,69.34 30.02,39.24 31.88,37.39 47.62,37.39 48.51,36.5 H20.1
A3: length 74
  Top Layer w0.406: H15.12 U9.29
  Bottom Layer w0.254: U9.29 17.02,68.89 23.62,68.89 24.08,68.43 24.08,68.05 24.51,67.61 27.69,67.61 28.7,66.6 28.7,33.96 30.35,32.31 45.21,32.31 45.97,33.07 H20.2
A4: length 81.6
  Top Layer w0.406: H15.11 U9.30
  Bottom Layer w0.254: H16.2 46.35,21.05 46.35,27.74 45.47,28.63 27.69,28.63 27.18,29.13 27.18,65.2 25.91,66.47 U9.30
A5: length 8.3
  Top Layer w0.406: H15.10 U9.31
A6: length 171.5
  Top Layer w0.254: v1(86.11,77.01) 86.11,63.42 88.77,60.76 88.77,56.31 89.92,55.17 91.57,55.17 93.22,53.52 94.87,53.52 95.5,52.88 H17.1
  Top Layer w0.406: H15.9 U9.32
  Bottom Layer w0.254: v1(86.11,77.01) 86.11,91.24 83.57,93.78 7.87,93.78 5.21,91.11 5.21,62.79 6.6,61.39 H15.9
A7: length 8.3
  Top Layer w0.406: H15.8 U9.33
A8: length 78.4
  Top Layer w0.406: U7.16 77.6,91.75 74.42,91.75 69.72,87.05 69.72,73.84 68.07,72.19 49.4,72.19 43.43,66.22 43.43,52.12 42.54,51.23 H4.16 U9.5
A9: length 8.5
  Top Layer w0.406: U9.6 H4.15
A10: length 71.6
  Top Layer w0.406: 77.72,76.5 80.01,76.5 80.52,76 80.52,57.84 79.63,56.95 56.9,56.95 54.55,54.6 v1(51.05,54.6) ; U9.7 H4.14
  Bottom Layer w0.406: v1(51.05,54.6) 44.01,54.6 42.29,56.31 H4.14
A11: length 8.5
  Top Layer w0.406: U9.8 H4.13
A12: length 106.7
  Top Layer w0.254: R2.1 71.27,45.79 69.85,44.37 v1(51.82,44.37) ; KEY3.2 KEY3.1 91.71,20.62 90.17,20.62 88.9,21.9 88.9,42.98 87.63,44.25 78.1,44.25 76.24,46.11 C2.1
  Top Layer w0.406: U9.9 H4.12
  Bottom Layer w0.254: R2.1 76.15,46.96 C2.1 ; v1(51.82,44.37) 51.82,55.3 49.78,57.33 43.56,57.33 42.8,58.09 42.8,60.88 42.29,61.39 H4.12
A15: length 8.5
  Top Layer w0.406: U9.10 H4.11
AO1: length 45
  Bottom Layer w0.406: 62.48,81.58 64.9,81.58 66.93,79.55 66.93,72.57 67.94,71.55 90.17,71.55 91.31,72.69 91.31,75.49 92.33,76.5 95.4,76.5 CN1.1
AO2: length 57
  Bottom Layer w0.406: U7.4 64.77,84.12 68.45,80.44 68.45,73.58 69.34,72.69 89.28,72.69 90.17,73.58 90.17,87.94 91.31,89.08 95.48,89.08 CN1.6
B0: length 153.1
  Top Layer w0.254: C1.1 77.89,53.52 91.31,53.52 92.46,52.38 92.46,37.68 KEY1.1 KEY1.2 ; v1(24.26,32.31) 28.07,32.31 28.96,31.42 49.66,31.42 52.2,33.96 52.2,39.04 52.71,39.55 55.37,39.55 56.77,40.94 70.23,40.94 72.9,43.61 72.9,53.39 71.27,55.02 R1.1 ; v1(24.26,36.88) 24.26,55.55 23.5,56.31 U9.34
  Top Layer w0.406: H15.7 U9.34
  Bottom Layer w0.254: v1(24.26,36.88) v1(24.26,32.31) ; C1.1 76.15,55.26 R1.1
B1: length 44.5
  Top Layer w0.406: H15.6 U9.35
  Bottom Layer w0.406: U9.35 24.13,53.77 25.4,52.5 U8.3
B2: length 39.4
  Top Layer w0.406: H15.5 U9.36
  Bottom Layer w0.406: U8.4 22.86,49.96 21.59,51.23 U9.36
B3: length 8.5
  Top Layer w0.406: U9.11 H4.10
B4: length 104.3
  Top Layer w0.254: R3.1 71.27,49.73 70.36,48.82 v1(52.58,48.82) ; KEY2.2 KEY2.1 90.55,29.98 90.55,47.3 88.9,48.95 78.31,48.95 C3.1
  Top Layer w0.406: U9.12 H4.9
  Bottom Layer w0.254: C3.1 76.15,51.11 R3.1 ; v1(52.58,48.82) 52.58,55.93 49.15,59.36 45.09,59.36 44.2,60.25 44.2,67.87 43.05,69.01 H4.9
B5: length 72.1
  Top Layer w0.254: U9.13 27.31,71.55 26.16,70.41 26.16,35.74 24.38,33.96 13.33,33.96 12.7,33.33 U8.8
  Top Layer w0.406: U9.13 H4.8
B6: length 129.4
  Top Layer w0.406: CN2.4 89.17,65.56 88.26,66.47 88.26,93.78 86.61,95.43 28.96,95.43 27.43,93.9 27.43,75.23 28.57,74.09 U9.14 H4.7
B7: length 109.8
  Top Layer w0.406: U9.15 H4.6 44.32,76.63 45.09,77.39 45.09,93.4 46.23,94.54 85.34,94.54 87.12,92.76 87.12,64.44 88.5,63.06 CN2.3
B8: length 61.8
  Top Layer w0.254: v1(51.94,58.72) 70.99,58.72 72.77,60.5 U11.3
  Top Layer w0.406: U9.16 H4.5
  Bottom Layer w0.254: v1(51.94,58.72) 51.94,78.28 51.05,79.17 H4.5
B9: length 61.9
  Top Layer w0.406: U9.17 H4.4
  Bottom Layer w0.254: H4.4 53.34,81.71 55.12,79.93 55.12,64.19 56.01,63.3 74.68,63.3 75.31,62.66 U11.4
B10: length 8.3
  Top Layer w0.406: H15.4 U9.37
B12: length 79.9
  Top Layer w0.406: U9.1 H4.20 48.13,41.07 49.91,42.85 49.91,64.31 51.69,66.09 73.91,66.09 75.06,67.23 75.06,77.52 76.58,79.05 U7.11
B13: length 79.1
  Top Layer w0.406: 77.72,81.58 75.95,81.58 74.04,79.68 74.04,68.89 72.77,67.61 51.05,67.61 48.26,64.82 48.26,45.26 46.61,43.61 H4.19 U9.2
B14: length 80.7
  Top Layer w0.406: U7.14 74.93,86.67 72.71,84.44 72.71,70.73 71.25,69.27 50.55,69.27 46.74,65.46 46.74,47.93 44.96,46.15 H4.18 U9.3
B15: length 79.3
  Top Layer w0.406: U9.4 H4.17 43.81,48.69 45.09,49.96 45.09,66.09 49.78,70.79 69.22,70.79 71.12,72.69 71.12,85.39 74.93,89.2 U7.15
BO1: length 48.8
  Bottom Layer w0.406: CN2.1 91.59,58.06 90.61,59.04 90.61,67.3 89.66,68.25 66.68,68.25 65.02,69.9 65.02,75.62 64.13,76.5 62.48,76.5
BO2: length 40.5
  Bottom Layer w0.406: U7.6 64.39,79.05 65.91,77.52 65.91,71.42 67.31,70.03 94.97,70.03 CN2.6
C13: length 8.3
  Top Layer w0.406: H15.19 U9.22
C14: length 8.3
  Top Layer w0.406: H15.18 U9.23
C15: length 8.3
  Top Layer w0.406: H15.17 U9.24
R: length 8.3
  Top Layer w0.406: H15.16 U9.25
VB: length 8.3
  Top Layer w0.406: H15.20 U9.21
$1N11569: length 9.5
  Top Layer w0.254: 53.65,30.4 53.65,24.89 54.36,24.18 57.15,24.18 LED6.2
$1N12499: length 9.5
  Top Layer w0.254: LED5.2 69.34,17.58 70.23,18.47 73.66,18.47 74.24,19.04 R9.2
$1N12503: length 7.9
  Top Layer w0.254: LED6.1 60.92,23.21 SW6.1

## Copper pours and planes (outline as drawn; the poured copper is in the pictures)
GND on Top Layer: -4.06,101.65 107.06,101.65 107.06,-6.04 -4.06,-6.04
GND on Bottom Layer: -3.94,103.3 105.44,103.3 105.44,-5.44 -3.94,-5.44

Small or netless copper shapes (teardrops, artwork), in the pictures only: 169 on Top Layer, 62 on Bottom Layer

## Text on the board
Top Silkscreen Layer: PA6 | 5V | GND | VCC | PA4 | 3V3 | 12V | !!舵机未使用开关控制!! | RX→ | ←TX | 蜂鸣器 | 舵机
